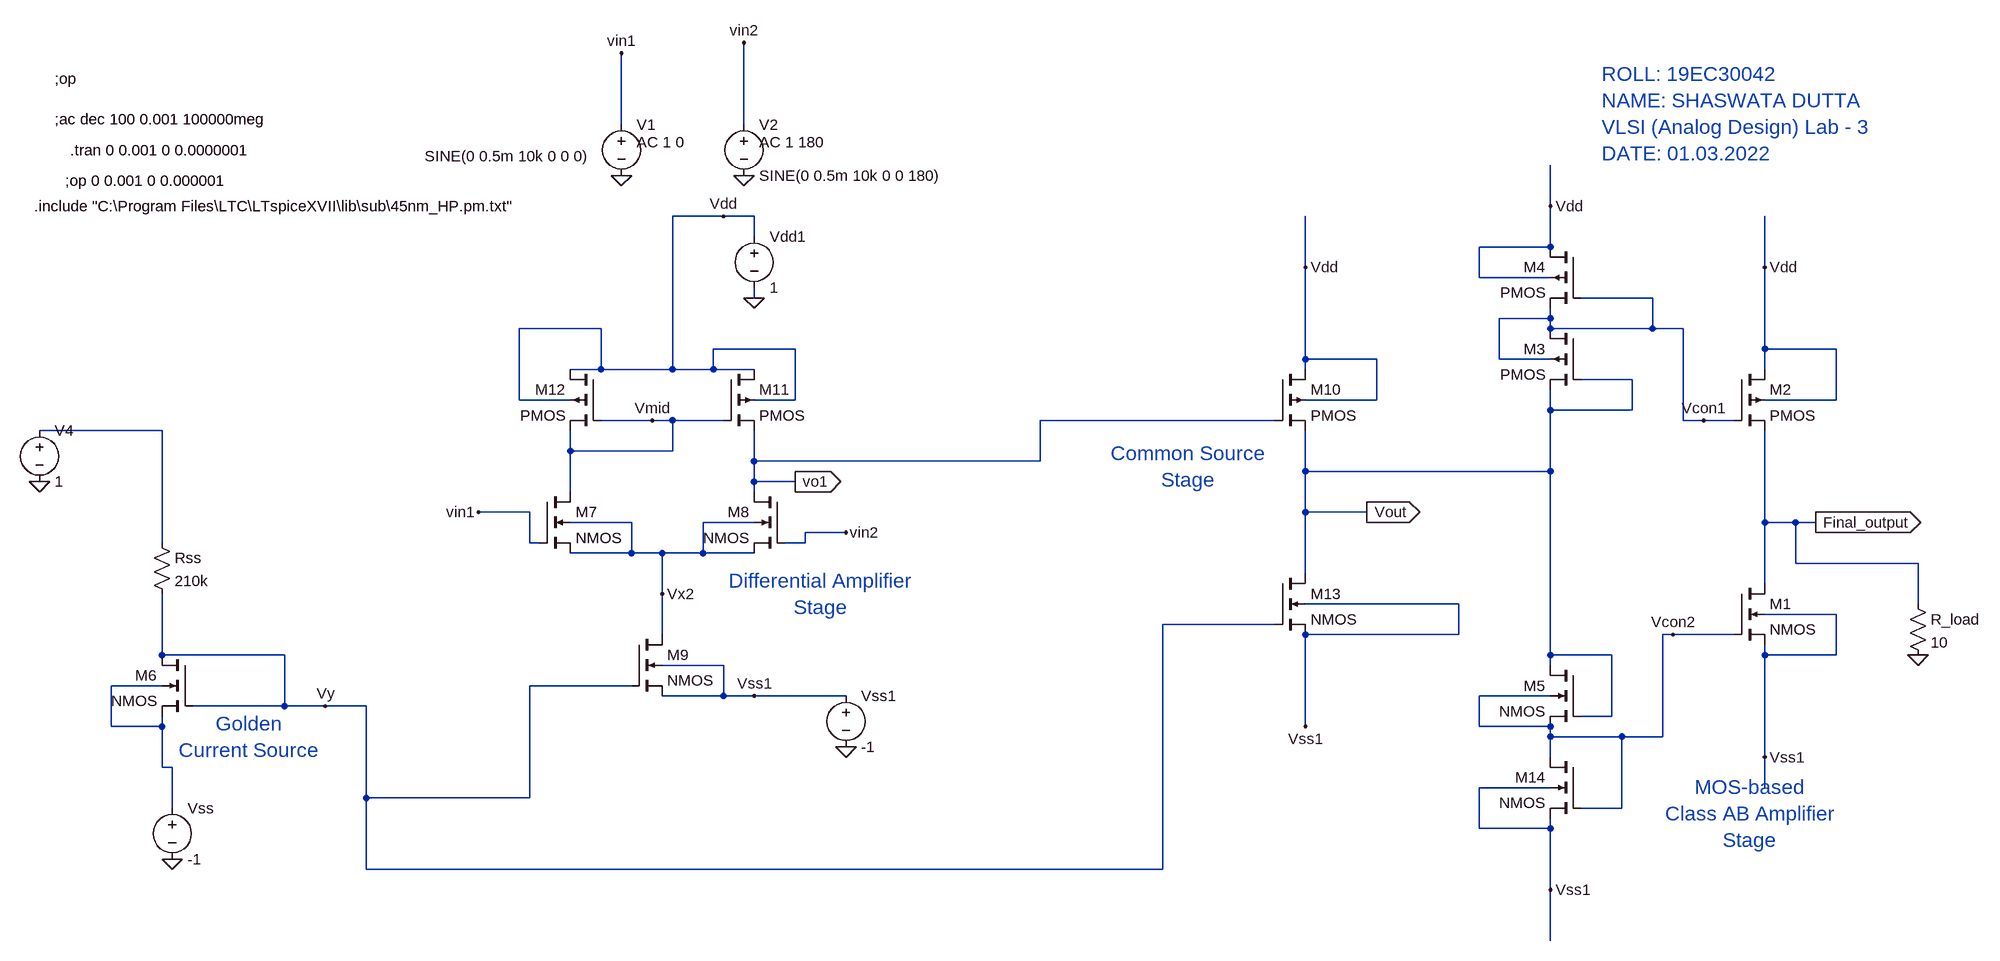
[diagram p0: schematic Op-Amp_final.asc]
Op-Amp_final.asc, the LTspice schematic file:
Version 4
SHEET 1 1908 680
WIRE -2608 -1216 -2608 -1328
WIRE -2416 -1216 -2416 -1344
WIRE -1152 -1088 -1152 -1152
WIRE -2448 -1072 -2528 -1072
WIRE -2400 -1072 -2448 -1072
WIRE -2400 -1040 -2400 -1072
WIRE -1152 -1024 -1152 -1088
WIRE -1152 -1024 -1264 -1024
WIRE -1536 -992 -1536 -1072
WIRE -816 -992 -816 -1072
WIRE -1264 -976 -1264 -1024
WIRE -1152 -976 -1264 -976
WIRE -2400 -944 -2400 -960
WIRE -992 -944 -1104 -944
WIRE -1152 -912 -1152 -928
WIRE -1152 -912 -1232 -912
WIRE -2640 -896 -2768 -896
WIRE -1152 -896 -1152 -912
WIRE -992 -896 -992 -944
WIRE -992 -896 -1152 -896
WIRE -944 -896 -992 -896
WIRE -2336 -864 -2464 -864
WIRE -816 -864 -816 -992
WIRE -704 -864 -816 -864
WIRE -1536 -848 -1536 -992
WIRE -1424 -848 -1536 -848
WIRE -1232 -848 -1232 -912
WIRE -1152 -848 -1232 -848
WIRE -2640 -832 -2640 -896
WIRE -2640 -832 -2688 -832
WIRE -2528 -832 -2528 -1072
WIRE -2528 -832 -2640 -832
WIRE -2464 -832 -2464 -864
WIRE -2464 -832 -2528 -832
WIRE -2400 -832 -2464 -832
WIRE -1536 -832 -1536 -848
WIRE -816 -832 -816 -864
WIRE -1024 -816 -1104 -816
WIRE -2768 -784 -2768 -896
WIRE -2688 -784 -2768 -784
WIRE -2336 -784 -2336 -864
WIRE -2336 -784 -2400 -784
WIRE -1424 -784 -1424 -848
WIRE -1424 -784 -1536 -784
WIRE -704 -784 -704 -864
WIRE -704 -784 -816 -784
WIRE -1152 -768 -1152 -800
WIRE -1024 -768 -1024 -816
WIRE -1024 -768 -1152 -768
WIRE -2560 -752 -2640 -752
WIRE -2528 -752 -2560 -752
WIRE -2448 -752 -2528 -752
WIRE -1584 -752 -1952 -752
WIRE -944 -752 -944 -896
WIRE -912 -752 -944 -752
WIRE -864 -752 -912 -752
WIRE -3328 -736 -3520 -736
WIRE -2688 -704 -2688 -736
WIRE -2528 -704 -2528 -752
WIRE -2528 -704 -2688 -704
WIRE -2400 -688 -2400 -736
WIRE -1952 -688 -1952 -752
WIRE -1952 -688 -2400 -688
WIRE -1536 -672 -1536 -736
WIRE -1152 -672 -1152 -768
WIRE -1152 -672 -1536 -672
WIRE -2400 -656 -2400 -688
WIRE -2336 -656 -2400 -656
WIRE -2688 -640 -2688 -704
WIRE -2400 -640 -2400 -656
WIRE -2752 -608 -2832 -608
WIRE -1536 -608 -1536 -672
WIRE -1440 -608 -1536 -608
WIRE -2592 -592 -2688 -592
WIRE -2400 -592 -2480 -592
WIRE -816 -592 -816 -736
WIRE -768 -592 -816 -592
WIRE -736 -592 -768 -592
WIRE -2256 -576 -2320 -576
WIRE -3328 -560 -3328 -736
WIRE -2752 -560 -2752 -608
WIRE -2736 -560 -2752 -560
WIRE -2320 -560 -2320 -576
WIRE -2320 -560 -2352 -560
WIRE -2592 -544 -2592 -592
WIRE -2592 -544 -2688 -544
WIRE -2544 -544 -2592 -544
WIRE -2480 -544 -2480 -592
WIRE -2480 -544 -2544 -544
WIRE -2400 -544 -2480 -544
WIRE -768 -528 -768 -592
WIRE -576 -528 -768 -528
WIRE -1536 -512 -1536 -608
WIRE -816 -496 -816 -592
WIRE -2544 -480 -2544 -544
WIRE -1296 -464 -1536 -464
WIRE -576 -464 -576 -528
WIRE -704 -448 -816 -448
WIRE -1584 -432 -1760 -432
WIRE -2544 -416 -2544 -480
WIRE -1296 -416 -1296 -464
WIRE -1296 -416 -1536 -416
WIRE -960 -416 -976 -416
WIRE -864 -416 -960 -416
WIRE -3328 -384 -3328 -480
WIRE -3136 -384 -3328 -384
WIRE -1152 -384 -1152 -672
WIRE -1056 -384 -1152 -384
WIRE -816 -384 -816 -400
WIRE -704 -384 -704 -448
WIRE -704 -384 -816 -384
WIRE -2448 -368 -2544 -368
WIRE -1152 -368 -1152 -384
WIRE -3328 -336 -3408 -336
WIRE -2592 -336 -2752 -336
WIRE -2448 -320 -2448 -368
WIRE -2448 -320 -2544 -320
WIRE -2400 -320 -2448 -320
WIRE -2256 -320 -2400 -320
WIRE -1152 -320 -1264 -320
WIRE -3136 -304 -3136 -384
WIRE -3136 -304 -3280 -304
WIRE -3072 -304 -3136 -304
WIRE -3008 -304 -3072 -304
WIRE -1056 -288 -1056 -384
WIRE -1056 -288 -1104 -288
WIRE -3408 -272 -3408 -336
WIRE -3328 -272 -3328 -288
WIRE -3328 -272 -3408 -272
WIRE -1536 -272 -1536 -416
WIRE -1264 -272 -1264 -320
WIRE -1152 -272 -1264 -272
WIRE -1152 -256 -1152 -272
WIRE -1040 -256 -1152 -256
WIRE -976 -256 -976 -416
WIRE -976 -256 -1040 -256
WIRE -1152 -224 -1152 -256
WIRE -816 -224 -816 -384
WIRE -3328 -208 -3328 -272
WIRE -3312 -208 -3328 -208
WIRE -1152 -176 -1264 -176
WIRE -816 -176 -816 -224
WIRE -3008 -160 -3008 -304
WIRE -2752 -160 -2752 -336
WIRE -2752 -160 -3008 -160
WIRE -3312 -144 -3312 -208
WIRE -1040 -144 -1040 -256
WIRE -1040 -144 -1104 -144
WIRE -1264 -112 -1264 -176
WIRE -1152 -112 -1152 -128
WIRE -1152 -112 -1264 -112
WIRE -3008 -48 -3008 -160
WIRE -1760 -48 -1760 -432
WIRE -1760 -48 -3008 -48
WIRE -1152 -16 -1152 -112
WIRE -1152 64 -1152 -16
FLAG -3520 -656 0
FLAG -3312 -64 0
FLAG -3072 -304 Vy
FLAG -2400 -944 0
FLAG -2256 -240 0
FLAG -2336 -656 vo1
IOPIN -2336 -656 Out
FLAG -2832 -608 vin1
FLAG -2256 -576 vin2
FLAG -2544 -480 Vx2
FLAG -2560 -752 Vmid
FLAG -2448 -1072 Vdd
FLAG -1536 -992 Vdd
FLAG -1440 -608 Vout
IOPIN -1440 -608 Out
FLAG -1536 -272 Vss1
FLAG -2400 -320 Vss1
FLAG -2608 -1328 vin1
FLAG -2416 -1344 vin2
FLAG -2608 -1136 0
FLAG -2416 -1136 0
FLAG -816 -992 Vdd
FLAG -816 -224 Vss1
FLAG -736 -592 Final_output
IOPIN -736 -592 Out
FLAG -576 -384 0
FLAG -1152 -1088 Vdd
FLAG -1152 -16 Vss1
FLAG -912 -752 Vcon1
FLAG -960 -416 Vcon2
SYMBOL nmos4 -3280 -384 M0
SYMATTR InstName M6
SYMATTR Value2 l=80n w=90n m=1
SYMBOL voltage -3520 -752 R0
WINDOW 123 0 0 Left 0
WINDOW 39 0 0 Left 0
SYMATTR InstName V4
SYMATTR Value 1
SYMBOL voltage -3312 -160 R0
WINDOW 123 0 0 Left 0
WINDOW 39 0 0 Left 0
SYMATTR InstName Vss
SYMATTR Value -1
SYMBOL res -3344 -576 R0
SYMATTR InstName Rss
SYMATTR Value 210k
SYMBOL nmos4 -2736 -640 R0
SYMATTR InstName M7
SYMATTR Value2 l=80n w=205n m=1
SYMBOL nmos4 -2352 -640 M0
SYMATTR InstName M8
SYMATTR Value2 l=80n w=205n m=1
SYMBOL nmos4 -2592 -416 R0
SYMATTR InstName M9
SYMATTR Value2 l=80n w=108n m=1
SYMBOL voltage -2400 -1056 R0
WINDOW 123 0 0 Left 0
WINDOW 39 0 0 Left 0
SYMATTR InstName Vdd1
SYMATTR Value 1
SYMBOL voltage -2256 -336 R0
WINDOW 123 0 0 Left 0
WINDOW 39 0 0 Left 0
SYMATTR InstName Vss1
SYMATTR Value -1
SYMBOL pmos4 -2448 -832 R0
SYMATTR InstName M11
SYMATTR Value2 l=80n w=245n m=1
SYMBOL pmos4 -2640 -832 M0
SYMATTR InstName M12
SYMATTR Value2 l=80n w=245n m=1
SYMBOL pmos4 -1584 -832 R0
SYMATTR InstName M10
SYMATTR Value2 l=80n w=3840n m=1
SYMBOL nmos4 -1584 -512 R0
SYMATTR InstName M13
SYMATTR Value2 l=80n w=1000n m=1
SYMBOL voltage -2608 -1232 R0
WINDOW 3 -308 66 Left 2
WINDOW 123 24 44 Left 2
WINDOW 39 0 0 Left 0
SYMATTR Value SINE(0 0.5m 10k 0 0 0)
SYMATTR Value2 AC 1 0
SYMATTR InstName V1
SYMBOL voltage -2416 -1232 R0
WINDOW 123 24 44 Left 2
WINDOW 39 0 0 Left 0
SYMATTR Value2 AC 1 180
SYMATTR InstName V2
SYMATTR Value SINE(0 0.5m 10k 0 0 180)
SYMBOL nmos4 -864 -496 R0
SYMATTR InstName M1
SYMATTR Value2 l=45n w=700000n m=1
SYMBOL pmos4 -864 -832 R0
SYMATTR InstName M2
SYMATTR Value2 l=45n w=540000n m=1
SYMBOL res -592 -480 R0
SYMATTR InstName R_load
SYMATTR Value 10
SYMBOL pmos4 -1104 -896 M0
SYMATTR InstName M3
SYMATTR Value2 l=45n w=81n m=1
SYMBOL pmos4 -1104 -1024 M0
SYMATTR InstName M4
SYMATTR Value2 l=45n w=81n m=1
SYMBOL nmos4 -1104 -368 M0
SYMATTR InstName M5
SYMATTR Value2 l=45n w=60n m=1
SYMBOL nmos4 -1104 -224 M0
SYMATTR InstName M14
SYMATTR Value2 l=45n w=60n m=1
TEXT -3480 -1128 Left 2 !;op 0 0.001 0 0.000001
TEXT -3528 -1088 Left 2 !.include "C:\\Program Files\\LTC\\LTspiceXVII\\lib\\sub\\45nm_HP.pm.txt"
TEXT -3496 -1224 Left 2 !;ac dec 100 0.001 100000meg
TEXT -1072 -1296 Left 3 ;ROLL: 19EC30042\nNAME: SHASWATA DUTTA\nVLSI (Analog Design) Lab - 3\nDATE: 01.03.2022
TEXT -3496 -1288 Left 2 !;op
TEXT -3472 -1176 Left 2 !.tran 0 0.001 0 0.0000001
TEXT -3192 -256 Center 3 ;Golden\nCurrent Source
TEXT -2296 -480 Center 3 ;Differential Amplifier\nStage
TEXT -1720 -680 Center 3 ;Common Source\nStage
TEXT -840 -136 Center 3 ;MOS-based\nClass AB Amplifier\nStage

The netlist it stands for:
* Op-Amp_final.asc
M6 Vy Vy N002 N002 NMOS l=80n w=90n m=1
V4 N001 0 1
Vss N002 0 -1
Rss N001 Vy 210k
M7 Vmid vin1 Vx2 Vx2 NMOS l=80n w=205n m=1
M8 vo1 vin2 Vx2 Vx2 NMOS l=80n w=205n m=1
M9 Vx2 Vy Vss1 Vss1 NMOS l=80n w=108n m=1
Vdd1 Vdd 0 1
Vss1 Vss1 0 -1
M11 Vdd Vmid vo1 Vdd PMOS l=80n w=245n m=1
M12 Vdd Vmid Vmid Vdd PMOS l=80n w=245n m=1
M10 Vdd vo1 Vout Vdd PMOS l=80n w=3840n m=1
M13 Vout Vy Vss1 Vss1 NMOS l=80n w=1000n m=1
V1 vin1 0 SINE(0 0.5m 10k 0 0 0) AC 1 0
V2 vin2 0 SINE(0 0.5m 10k 0 0 180) AC 1 180
M1 Final_output Vcon2 Vss1 Vss1 NMOS l=45n w=700000n m=1
M2 Vdd Vcon1 Final_output Vdd PMOS l=45n w=540000n m=1
R_load Final_output 0 10
M3 Vcon1 Vout Vout Vcon1 PMOS l=45n w=81n m=1
M4 Vdd Vcon1 Vcon1 Vdd PMOS l=45n w=81n m=1
M5 Vout Vout Vcon2 Vcon2 NMOS l=45n w=60n m=1
M14 Vcon2 Vcon2 Vss1 Vss1 NMOS l=45n w=60n m=1
.model NMOS NMOS
.model PMOS PMOS
.lib standard.mos
;op 0 0.001 0 0.000001
.include "C:\Program Files\LTC\LTspiceXVII\lib\sub\45nm_HP.pm.txt"
;ac dec 100 0.001 100000meg
* ROLL: 19EC30042
* NAME: SHASWATA DUTTA
* VLSI (Analog Design) Lab - 3
* DATE: 01.03.2022
;op
.tran 0 0.001 0 0.0000001
* Golden
* Current Source
* Differential Amplifier
* Stage
* Common Source
* Stage
* MOS-based
* Class AB Amplifier
* Stage
.backanno
.end